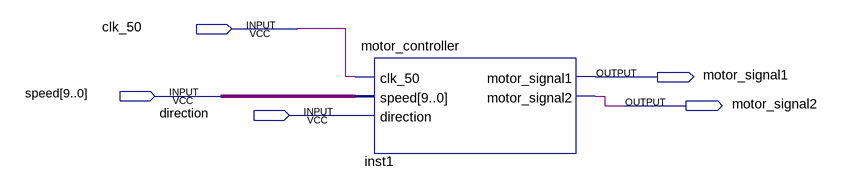
[diagram p0: schematic sheet]
// Quartus schematic motor_test.bdf as structural Verilog: 1 symbols, 5 pins
module motor_test (
  input  clk_50,
  input  [9:0] speed,
  input  direction,
  output motor_signal1,
  output motor_signal2
);

  motor_controller inst1 (
    .clk_50(clk_50), .speed(speed), .direction(direction), .motor_signal1(motor_signal1),
    .motor_signal2(motor_signal2));
endmodule
